# Altium project BACKPMAN3Rev1.0.PrjPcb (part 2 of 2)

## Sheet BACKPMAN30_Intfs.SchDoc
size A3
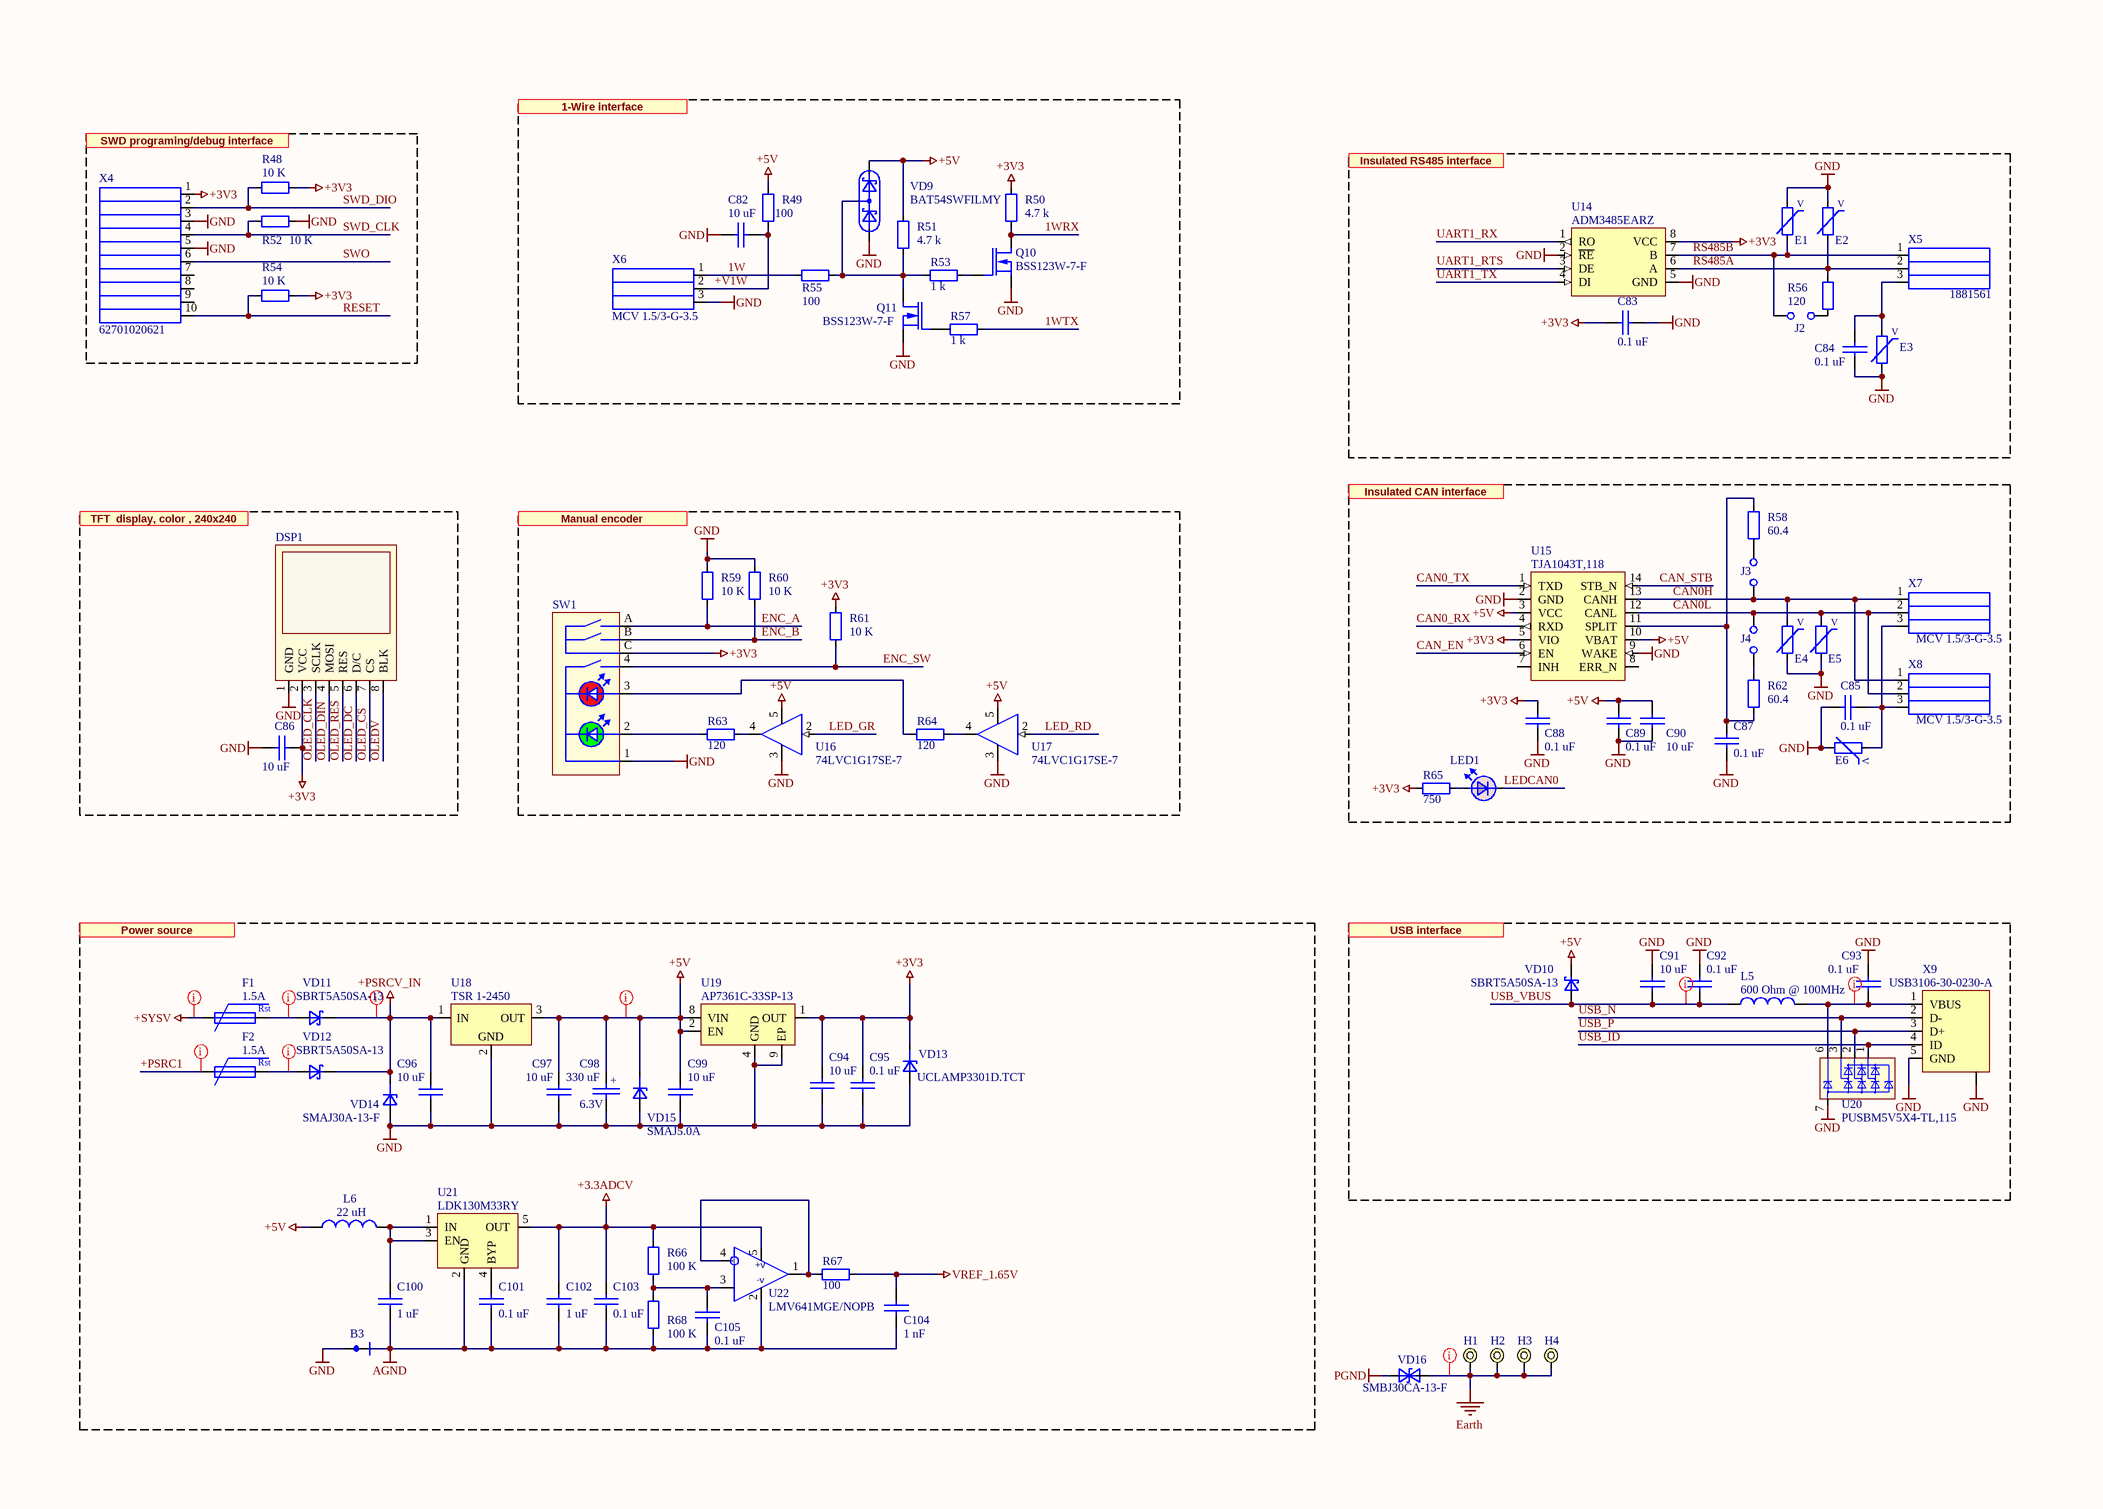
[diagram p2: BACKPMAN30_Intfs.SchDoc]

### Parts
B3  Net tie 0.3mm  [Net tee 0.3 mm]  (value not drawn)  (net tie, no BOM)
C82  value 10 uF  [2012[0805]]  (hidden comment: GRM21BR61E106KA73L)
C83  value 0.1 uF  [1608[0603]]  (hidden comment: 0603B104K500CT)
C84  value 0.1 uF  [1608[0603]]  (hidden comment: CL10B104KA8NNND)
C85  value 0.1 uF  [1608[0603]]  (hidden comment: CL10B104KA8NNND)
C86  value 10 uF  [2012[0805]]  (hidden comment: GRM21BR61E106KA73L)
C87  value 0.1 uF  [1608[0603]]  (hidden comment: CL10B104KA8NNND)
C88  value 0.1 uF  [1608[0603]]  (hidden comment: CL10B104KA8NNND)
C89  value 0.1 uF  [1608[0603]]  (hidden comment: CL10B104KA8NNND)
C90  value 10 uF  [2012[0805]]  (hidden comment: GRM21BR61E106KA73L)
C91  value 10 uF  [2012[0805]]  (hidden comment: GRM21BR61E106KA73L)
C92  value 0.1 uF  [1608[0603]]  (hidden comment: CL10B104KA8NNND)
C93  value 0.1 uF  [1608[0603]]  (hidden comment: CL10B104KA8NNND)
C94  value 10 uF  [2012[0805]]  (hidden comment: GRM21BR61E106KA73L)
C95  value 0.1 uF  [1608[0603]]  (hidden comment: CL10B104KA8NNND)
C96  value 10 uF  [3225[1210]]  (hidden comment: GMC32X7R106K50NT)
C97  value 10 uF  [2012[0805]]  (hidden comment: GRM21BR61E106KA73L)
C98  value 330 uF  Voltage: 6.3V  [T495 D]  (hidden comment: T495D337K006ATE100)
C99  value 10 uF  [2012[0805]]  (hidden comment: GRM21BR61E106KA73L)
C100  value 1 uF  [1608[0603]]  (hidden comment: C1608X5R1H105K080AB)
C101  value 0.1 uF  [1608[0603]]  (hidden comment: 0603B104K500CT)
C102  value 1 uF  [1608[0603]]  (hidden comment: C1608X5R1H105K080AB)
C103  value 0.1 uF  [1608[0603]]  (hidden comment: 0603B104K500CT)
C104  value 1 nF  [0603 CAP]  (hidden comment: Capacitor)
C105  value 0.1 uF  [1608[0603]]  (hidden comment: 0603B104K500CT)
DSP1  1.54_inch_IPS_Module  [1.54 inch IPS 240x240]  (value not drawn)
E1  ESD03A5V5R17V  [0603]  (value not drawn)
E2  ESD03A5V5R17V  [0603]  (value not drawn)
E3  823 560 505 60  [0603]  (value not drawn)
E4  ESD03A5V5R17V  [0603]  (value not drawn)
E5  ESD03A5V5R17V  [0603]  (value not drawn)
E6  ESD03A5V5R17V  [0603]  (value not drawn)
F1  value 1.5A  [2920 (7351 Metric)]  (hidden comment: 0ZCF0075AF2C)
F2  value 1.5A  [2920 (7351 Metric)]  (hidden comment: 0ZCF0075AF2C)
H1  Hole 5MM Plated  [HOLE_5MM plated]  (value not drawn)  (no BOM)
H2  Hole 5MM Plated  [HOLE_5MM plated]  (value not drawn)  (no BOM)
H3  Hole 5MM Plated  [HOLE_5MM plated]  (value not drawn)  (no BOM)
H4  Hole 5MM Plated  [HOLE_5MM plated]  (value not drawn)  (no BOM)
J2  PH1-02-TA-HT  [HDR1X2V]  (value not drawn)
J3  PH1-02-TA-HT  [HDR1X2V]  (value not drawn)
J4  PH1-02-TA-HT  [HDR1X2V]  (value not drawn)
L5  value 600 Ohm @ 100MHz  [0805]  (hidden comment: MPZ2012S601AT000)
L6  value 22 uH  [2518]  (hidden comment: BRC2518T220K)
LED1  SML-211UTT86  [0805 LED]  (value not drawn)
Q10  BSS123W-7-F  [SOT323-3]
Q11  BSS123W-7-F  [SOT323-3]
R48  value 10 K  [0603]  (hidden comment: RMCF0603FT10K0)
R49  value 100  [0603]  (hidden comment: Resistor)
R50  value 4.7 k  [0603]  (hidden comment: Resistor)
R51  value 4.7 k  [0603]  (hidden comment: Resistor)
R52  value 10 K  [0603]  (hidden comment: RMCF0603FT10K0)
R53  value 1 k  [0603]  (hidden comment: Resistor)
R54  value 10 K  [0603]  (hidden comment: RMCF0603FT10K0)
R55  value 100  [0603]  (hidden comment: Resistor)
R56  value 120  [0603]  (hidden comment: Resistor)
R57  value 1 k  [0603]  (hidden comment: Resistor)
R58  value 60.4  [0603]  (hidden comment: Resistor)
R59  value 10 K  [0603]  (hidden comment: RMCF0603FT10K0)
R60  value 10 K  [0603]  (hidden comment: RMCF0603FT10K0)
R61  value 10 K  [0603]  (hidden comment: RMCF0603FT10K0)
R62  value 60.4  [0603]  (hidden comment: Resistor)
R63  value 120  [0603]  (hidden comment: Resistor)
R64  value 120  [0603]  (hidden comment: Resistor)
R65  value 750  [0603]  (hidden comment: Resistor)
R66  value 100 K  [0603]  (hidden comment: RG1608N-104-W-T1)
R67  value 100  [0603]  (hidden comment: Resistor)
R68  value 100 K  [0603]  (hidden comment: RG1608N-104-W-T1)
SW1  PEL12D-4225S-S2024  [PEL12D-4225S-S2024]  (value not drawn)
U14  ADM3485EARZ  [SO-8]
U15  TJA1043T,118  [SOT108-1]
U16  74LVC1G17SE-7  [SOT-353 ON Semi]
U17  74LVC1G17SE-7  [SOT-353 ON Semi]
U18  TSR 1-2450  [TSR 1 Traco Power]
U19  AP7361C-33SP-13  [SOIC-8 EDP]
U20  PUSBM5V5X4-TL,115  [DFN1616-6]
U21  LDK130M33RY  [SOT23-5]
U22  LMV641MGE/NOPB  [SOT-353 ON Semi]
VD9  BAT54SWFILMY  [SOT323-3]
VD10  SBRT5A50SA-13  [SMA]
VD11  SBRT5A50SA-13  [SMA]
VD12  SBRT5A50SA-13  [SMA]
VD13  UCLAMP3301D.TCT  [SOD-323]
VD14  SMAJ30A-13-F  [SMA]
VD15  SMAJ5.0A  [SMA]
VD16  SMBJ30CA-13-F  [DO-214AA_SMBJ BI]
X4  62701020621  [SHF-105-01-L-D-SM]
X5  1881561  [1881561]
X6  MCV 1.5/3-G-3.5  [mcv1.5-3-g_3.5 green + MC 1,5 3-ST-3,5 - 1840379]
X7  MCV 1.5/3-G-3.5  [mcv1.5-3-g_3.5 green + MC 1,5 3-ST-3,5 - 1840379]
X8  MCV 1.5/3-G-3.5  [mcv1.5-3-g_3.5 green + MC 1,5 3-ST-3,5 - 1840379]
X9  USB3106-30-0230-A  [USB3106-30-0230-A]

### Nets
+3.3ADCV: C102.2 C103.1 R66.2 U21.5(OUT) U22.5(V+)
+3V3: C83.1 C86.2 C88.2 C94.2 C95.2 DSP1.2(VCC) R48.2 R50.1 R54.2 R61.2 R65.2 SW1.C U14.8(VCC) U15.5(VIO) U19.1(OUT) VD13.1(C) X4.1
+5V: C89.2 C90.2 C97.2 C98.1 C99.2 L6.1 R49.2 R51.1 U15.3(VCC) U15.10(VBAT) U16.5(VCC) U17.5(VCC) U18.3(OUT) U19.2(EN) U19.8(VIN) VD9.2 VD10.1 VD15.1
+PSRCV_IN: C96.1 U18.1(IN) VD11.1 VD12.1 VD14.1
+SYSV: F1.1
AGND: B3.1 C100.1 C101.2 C102.1 C103.2 C104.2 C105.2 R68.1 U21.2(GND) U22.2(GND)
Earth: H1.0 H2.0 H3.0 H4.0 VD16.2(A)
GND: B3.2 C82.2 C83.2 C84.2 C85.2 C86.1 C87.1 C88.1 C89.1 C90.1 C91.2 C92.2 C93.2 C94.1 C95.1 C96.2 C97.1 C98.2 C99.1 DSP1.1(GND) E1.2 E2.2 E3.1 E4.1 E5.1 E6.1 Q10.2(S) Q11.2(S) R52.2 R59.2 R60.2 SW1.1 U14.2(~{RE}) U14.5(GND) U15.2(GND) U15.9(WAKE) U16.3(GND) U17.3(GND) U18.2(GND) U19.4(GND) U19.9(EP) U20.7 VD9.1 VD13.2(A) VD14.2 VD15.2 X4.3 X4.5 X6.3 X9.0 X9.5(GND)
PGND: VD16.1(C)
VREF_1.65V: C104.1 R67.1
1W: R55.1 X6.1
1WRX: Q10.3(D) R50.2
1WTX: R57.1
+PSRC1: F2.1
+V1W: C82.1 R49.1 X6.2
CAN0_RX: U15.4(RXD)
CAN0_TX: U15.1(TXD)
CAN0H: E4.2 J3.2 U15.13(CANH) X7.1 X8.1
CAN0L: E5.2 J4.1 U15.12(CANL) X7.2 X8.2
CAN_EN: U15.6(EN)
CAN_STB: U15.14(STB_N)
ENC_A: R59.1 SW1.A
ENC_B: R60.1 SW1.B
ENC_SW: R61.1 SW1.4
LED_GR: U16.2(A)
LED_RD: U17.2(A)
LEDCAN0: LED1.2
OLED_CLK: DSP1.3(SCLK)
OLED_CS: DSP1.7(CS)
OLED_DC: DSP1.6(D/C)
OLED_DIN: DSP1.4(MOSI)
OLED_RES: DSP1.5(RES)
OLEDV: DSP1.8(BLK)
RESET: R54.1 X4.10
RS485A: E2.1 R56.2 U14.6(A) X5.2
RS485B: E1.1 J2.1 U14.7(B) X5.1
SWD_CLK: R52.1 X4.4
SWD_DIO: R48.1 X4.2
SWO: X4.6
UART1_RTS: U14.3(DE)
UART1_RX: U14.1(RO)
UART1_TX: U14.4(DI)
USB_ID: U20.1 X9.4(ID)
USB_N: U20.3 X9.2(D-)
USB_P: U20.2 X9.3(D+)
USB_VBUS: C91.1 C92.1 L5.2 VD10.2
NetC84_1: C84.1 E3.2 X5.3
NetC85_1: C85.1 E6.2 X7.3 X8.3
NetC87_2: C87.2 R58.2 R62.1 U15.11(SPLIT)
NetC93_1: C93.1 L5.1 U20.6 X9.1(VBUS)
NetC100_2: C100.2 L6.2 U21.1(IN) U21.3(EN)
NetC101_1: C101.1 U21.4(BYP)
NetC105_1: C105.1 R66.1 R68.2 U22.3(IN+)
NetF1_2: F1.2 VD11.2
NetF2_2: F2.2 VD12.2
NetJ2_2: J2.2 R56.1
NetJ3_1: J3.1 R58.1
NetJ4_2: J4.2 R62.2
NetLED1_1: LED1.1 R65.1
NetQ10_1: Q10.1(G) R53.1
NetQ11_1: Q11.1(G) R57.2
NetQ11_3: Q11.3(D) R51.2 R53.2 R55.2 VD9.3
NetR63_1: R63.1 U16.4(Y)
NetR63_2: R63.2 SW1.2
NetR64_1: R64.1 U17.4(Y)
NetR64_2: R64.2 SW1.3
NetR67_2: R67.2 U22.1(OUT) U22.4(IN-)

Not connected (* = marked no-connect by the designer): U15 7(INH) 8(ERR_N); X4 7 8 9

### Layout directives
net class 24V: +PSRC1, +PSRCV_IN, +SYSV, Earth, NetF1_2, NetF2_2
net class 5V: +5V, NetC93_1, USB_VBUS

### Notes on the sheet
- 1-Wire interface
- SWD programing/debug interface
- Insulated RS485 interface
- Insulated CAN interface
- TFT  display, color , 240x240
- (near R59) Manual encoder
- Power source
- USB interface
- (in symbol 0ZCF0075AF2C) Rst
- (in symbol ESD03A5V5R17V) V
- (in symbol LMV641MGE/NOPB) +v; -v
- (in symbol T495D337K006ATE100) +

### Library data of the parts
C82 C86 C90 C91 C94 C97 C99 = GRM21BR61E106KA73L: 10 µF ±10%, 25V, Ceramic Capacitor X5R 0805 (2012 Metric),  -55°C ~ 85°C; Manufacturer: Murata Electronics; PartNum: 490-5523-1-ND; Distributor: Digi-Key; Price: 0.11$; Tolerance: ±10%; Voltage: 25V; PartName: GRM21BR61E106KA73L
C83-C85 C87-C89 C92 C93 C95 C101 C103 C105 = 0603B104K500CT: as C1 on sheet BACKPMAN30_Charger; Distributor: Digi-Key; PartName: 0603B104K500CT; Price: 0.0062 Euro; Voltage: 50V
C96 = GMC32X7R106K50NT: as C14 on sheet BACKPMAN30_Charger; Distributor: Digi-Key; PartName: GMC32X7R106K50NT; Tolerance: ±10%; Voltage: 50V
C98 = T495D337K006ATE100: 330 µF Molded Tantalum Capacitors 6.3 V 2917 (7343 Metric) 100mOhm, -55°C ~ 125°C; Manufacturer: KEMET; PartNum: 399-3883-1-ND; Tolerance: ±10%; Distributor: Digi-Key; Price: 0.089 Euro; PartName: T495D337K006ATE100
C100 C102 = C1608X5R1H105K080AB: 1 uF, ±10%, Low ESL, 50V, Ceramic Capacitor X5R 0603 (1608 Metric), -55°C ~ 85°C; Manufacturer: Venkel; PartNum: 445-7468-1-ND; Distributor: Digi-Key; PartName: C1608X5R1H105K080AB; Tolerance: ±10%; Voltage: 50V
C104 = CC0603JRX7R9BB102: as C3 on sheet BACKPMAN30_Charger; Voltage - Rated: 50V; Part Number: CC0603JRX7R9BB102; Distributor: Digi-Key; PartName: CC0603JRX7R9BB102; Price: 0.01920; Tolerance: ±5%; Temperature Coefficient: X7R; Operating Temperature: -55°C ~ 125°C; Features: -; Package / Case: 0603 (1608 Metric)
DSP1 = 1.54_inch_IPS_Module: 1.54-inch color screen,support 65K color display, 4-line SPI interface, 240x240 resolution, 32.00x43.72 mm; PartNum: MSP1541; PartName: 1.54 inch IPS Module; Distributor: Aliexpress; Price: 7.36
E1-E6 = ESD03A5V5R17V: Low and Ultra Low Capacitance ESD Suppressor, Voperating=5.5V, Vclamp=17V, < 1nS,1nA, 0603,; Manufacturer: Stackpole Electronics Inc; PartNum: ESD03A5V5R17VCT-ND; Voltage: 17V; Distributor: Digi-Key; PartName: ESD03A5V5R17V; Price: 0.1$
F1 F2 = 0ZCF0075AF2C: PTC RESETTABLE 60V 750MA, It=1.5A, 0.3s 2920(7351); Manufacturer: Bel Fuse Inc.; PartNum: 507-1743-1-ND; Distributor: Digi-Key; PartName: 0ZCF0075AF2C
J2-J4 = PH1-02-UA: Connector Header Through Hole 2 position 0.100" (2.54mm), Contact Length - Mating 6 mm; Manufacturer: Adam Tech; PartNum: 2057-PH1-02-UA-ND; Distributor: Digi-Key; PartName: PH1-02-UA
L5 = MPZ2012S601AT000: FERRITE BEAD 600 OHM, 0805, -55°C ~ 125°C; Manufacturer: TDK Corporation; PartNum: 445-2206-1-ND; Distributor: Digi-Key; Price: 0.05$; PartName: MPZ2012S601AT000
L6 = BRC2518T220K: as L1 on sheet BACKPMAN30_Charger; Distributor: Digi-Key; PartName: BRC2518T220K; Supplier 1: Digi-Key; Supplier Part Number 1: 587-2439-1-ND
LED1 = SML-211UTT86: 0805 red LED, hibright, 2 mA, 1.8V, 130°; Manufacturer: Rohm; PartNum: 511-1292-1-ND; Distributor: Digi-Key; Price: 0.34$; Value: Red; PartName: SML-211UTT86
Q10 Q11 = BSS123W-7-F: MOSFETs N-CH, 2V @ 1mA, 6 Ohm @ 170mA, 10V, 170mA, 100V, SOT-323,  -55°C ~ 150°C; Manufacturer: Diodes Incorporated; PartNum: BSS123W-FDICT-ND; Distributor: Digi-Key; Price: 0.15$; PartName: BSS123W-7-F
R48 R52 R54 R59-R61 = RMCF0603FT10K0: 10 kOhms ±1%, ±100ppm/°C,  0.1W, 1/10W Chip Resistor 0603 (1608 Metric) Automotive AEC-Q200 Thick Film, -55°C ~ 155°C; Manufacturer: Stackpole Electronics Inc; PartNum: RMCF0603FT10K0CT-ND; Distributor: Digi-Key; Price: 0.0017$; Tolerance: 1%; PartName: RMCF0603FT10K0
R49 R55 R67 = RMCF0603FT100R: 100 Ohms, ±1%, 0.1W, 1/10W, Thick Film, ±100ppm/°C, 0603 (1608 Metric), -55°C ~ 155°C, Automotive AEC-Q200; Manufacturer: Stackpole Electronics Inc.; PartNum: RMCF0603FT100RCT-ND; Voltage: 75V; Distributor: Digi-Key; Price: 0.00690; Tolerance: ±1%; PartName: RMCF0603FT100R; Part Number: RMCF0603FT100R; Temperature Coefficient: ±100ppm/°C; Operating Temperature: -55°C ~ 155°C; Power (Watts): 0.1W, 1/10W; Features: Automotive AEC-Q200; Package / Case: 0603 (1608 Metric)
R50 R51 = RMCF0603FT4K70: 4.7 kOhms, ±1%, 0.1W, 1/10W, Thick Film, ±100ppm/°C, 0603 (1608 Metric), -55°C ~ 155°C, Automotive AEC-Q200; Manufacturer: Stackpole Electronics Inc.; PartNum: RMCF0603FT4K70CT-ND; Voltage: 75V; Distributor: Digi-Key; Price: 0.00690; Tolerance: ±1%; PartName: RMCF0603FT4K70; Part Number: RMCF0603FT4K70; Temperature Coefficient: ±100ppm/°C; Operating Temperature: -55°C ~ 155°C; Power (Watts): 0.1W, 1/10W; Features: Automotive AEC-Q200; Package / Case: 0603 (1608 Metric)
R53 R57 = RMCF0603FG1K00: as R23 on sheet BACKPMAN30_Charger; Distributor: Digi-Key; Price: 0.00690; Tolerance: ±1%; PartName: RMCF0603FG1K00; Part Number: RMCF0603FG1K00; Temperature Coefficient: ±100ppm/°C; Operating Temperature: -55°C ~ 155°C; Power (Watts): 0.1W, 1/10W; Features: Automotive AEC-Q200; Package / Case: 0603 (1608 Metric)
R56 R63 R64 = RMCF0603FT120R: 120 Ohms, ±1%, 0.1W, 1/10W, Thick Film, ±100ppm/°C, 0603 (1608 Metric), -55°C ~ 155°C, Automotive AEC-Q200; Manufacturer: Stackpole Electronics Inc.; PartNum: RMCF0603FT120RCT-ND; Voltage: 75V; Distributor: Digi-Key; Price: 0.00690; Tolerance: ±1%; PartName: RMCF0603FT120R; Temperature Coefficient: ±100ppm/°C; Operating Temperature: -55°C ~ 155°C; Power (Watts): 0.1W, 1/10W; Features: Automotive AEC-Q200; Package / Case: 0603 (1608 Metric)
  R63 R64: Part Number: RMCF0603FT120R
R58 R62 = CRCW060360R4FKEA: 60.4 Ohms, ±1%, 0.1W, 1/10W, Thick Film, ±100ppm/°C, 0603 (1608 Metric), -55°C ~ 155°C, Automotive AEC-Q200; Manufacturer: Vishay Dale; PartNum: 541-60.4HCT-ND; Voltage: 75V; Distributor: Digi-Key; Price: 0.01700; Tolerance: ±1%; PartName: CRCW060360R4FKEA; Part Number: CRCW060360R4FKEA; Temperature Coefficient: ±100ppm/°C; Operating Temperature: -55°C ~ 155°C; Power (Watts): 0.1W, 1/10W; Features: Automotive AEC-Q200; Package / Case: 0603 (1608 Metric)
R65 = RMCF0603FT750R: 750 Ohms, ±1%, 0.1W, 1/10W, Thick Film, ±100ppm/°C, 0603 (1608 Metric), -55°C ~ 155°C, Automotive AEC-Q200; Manufacturer: Stackpole Electronics Inc.; PartNum: RMCF0603FT750RCT-ND; Voltage: 75V; Distributor: Digi-Key; Price: 0.00690; Tolerance: ±1%; PartName: RMCF0603FT750R; Temperature Coefficient: ±100ppm/°C; Operating Temperature: -55°C ~ 155°C; Power (Watts): 0.1W, 1/10W; Features: Automotive AEC-Q200; Package / Case: 0603 (1608 Metric)
R66 R68 = RG1608N-104-W-T1: 100 kOhms ±0.05% 0.1W, 1/10W Chip Resistor 0603 (1608 Metric) Anti-Sulfur, Automotive AEC-Q200 Thin Film,-55°C ~ 155°C; Manufacturer: Susumu; PartNum: RG16N100KWCT-ND; Distributor: Digi-Key; Price: 0.002$; Tolerance: ±0.05%; PartName: RG1608N-104-W-T1
SW1 = PEL12D-4225S-S2024: Rotary Encoder Mechanical 24 Quadrature (Incremental) Vertical; Manufacturer: Bourns Inc.; PartNum: PEL12D-4225S-S2024-ND; Distributor: Digi-Key; PartName: PEL12D-4225S-S2024; Price: 3.62$
U14 = ADM3485EARZ: 1/1 Transceiver Half RS422, RS485, VCC 3.3 V,  8-SOIC, -40°C ~ 85°C; Manufacturer: Analog Devices; PartNum: 584-ADM3485EARZ-R7; Price: 2.35$; Distributor: Mouser; PartName: ADM3485EARZ
U15 = TJA1043T,118: 1/1 Transceiver Half CANbus, 5Mbps, 4.5-5.5V, 3V IO,  14-SO, -40°C ~ 150°C; Manufacturer: NXP; PartNum: 2776120RL; Price: 1.41; Distributor: Farnell; PartName: TJA1043T,118
U16 U17 = 74LVC1G17SE-7: IC SGL SCHMITT BUFFER SOT353; Manufacturer: Diodes Incorporated; PartNum: 74LVC1G17SE-7CT-ND; Distributor: Digi-Key; PartName: 74LVC1G17SE-7
U18 = TSR 1-2450: Linear Regulator Replacement DC DC Converter 5W, 5V, 1A, 6.5V - 36V Input, -40°C ~ 85°C; Manufacturer: Traco Power; PartNum: 1951-2747-ND; Distributor: Digi-Key; price: 3.9$; PartName: TSR 1-2450
U19 = AP7361C-33SP-13: LDO, 3.3 V, 1A, 0.36V@1A, Vin=6V max, -40..+85C, 8-SO-EP; PartNum: AP7361C-33SP-13DICT-ND; Manufacturer: Diodes Incorporated; Distributor: Digi-Key; Price: 0.56$; PartName: AP7361C-33SP-13
U20 = PUSBM5V5X4-TL,115: TVS DIODE 5.5VWM 12VC 6HXSON; Manufacturer: NXP Semiconductors; PartNum: 568-10921-1-ND; Distributor: Digi-Key; PartName: PUSBM5V5X4-TL,115
U21 = LDK130M33RY: LDO 3.3 V, 250 mA, Vin < 5.5V, Iq < 12uA, -40..+125 C, SOT23-5; Manufacturer: STMicroelectronics; PartNum: 511-LDK130M33RY; Price: 0.543; Distributor: Mouser; PartName: LDK130M33RY
U22 = LMV641MGE/NOPB: as U1 on sheet BACKPMAN30_Charger; Price: 1.8$; Distributor: Digi-Key; PartName: LMV641MGE/NOPB; Supplier 1: Digi-Key; Supplier Part Number 1: 296-OPA991IDBVRCT-ND
VD9 = BAT54SWFILMY: Series Shottky Diodes array, 40V, 300 mA, SOT-323, -40°C...150°C; Manufacturer: STMicroelectronics; PartNum: 497-17757-1-ND; Distributor: Digi-Key; PartName: BAT54SWFILMY
VD10-VD12 = SBRT5A50SA-13: Schottky Power Rectifier 3A, 40V, SMA; Manufacturer: Diodes Incorporated; PartNum: SBRT5A50SA-13DICT-ND; Price: 0,15$; Distributor: Digi-Key; PartName: SBRT5A50SA-13
VD13 = UCLAMP3301D.TCT: TVS 3.3V (Max), Vbr=3.5V, 9.5V Clamp 10A (8/20µs) Ipp Tvs Diode Surface Mount SOD-323; Manufacturer: Semtech Corporation; PartNum: UCLAMP3301DCT-ND; Distributor: Digi-Key; Value: 3.3V; PartName: UCLAMP3301D.TCT
VD14 = SMAJ30A-13-F: 48.4V Clamp 8.3A Ipp Tvs Diode Surface Mount SMA,; Manufacturer: Diodes Incorporated; PartNum: SMAJ30A-FDICT-ND; Voltage: 30 V; Distributor: Digi-Key; Price: 0.18$; PartName: SMAJ30A-13-F
VD15 = SMAJ5.0A: 9.2V Clamp 43.5A Ipp Tvs Diode Surface Mount SMA, -55°C ~ 150°C (TJ); Manufacturer: Littelfuse Inc.; PartNum: SMAJ5.0ALFCT-ND; Voltage: 30 V; Distributor: Digi-Key; Price: 0.18$; PartName: SMAJ5.0A
VD16 = SMBJ30CA-13-F: TVS 600W, Vbr=33.3V, Vcl=48.4V,  Bidirectional, SMB, -55°C ~ 150°C; Manufacturer: Diodes Incorporated; PartNum: SMBJ30CA-FDICT-ND; Voltage: 30V; Distributor: Digi-Key; Price: 0.21$; PartName: SMBJ30CA-13-F; Supplier 1: Digi-Key; Supplier Part Number 1: SMBJ30CA-FDICT-ND
X4 = 62701020621: 10 Positions Header Connector 0.050" (1.27mm) Surface Mount Gold; Manufacturer: Wurth; Distributor: we-online.com; Price: 4.36$; PartNum: 62701020621; PartName: 62701020621
X5 = 1881561: Printed-circuit board connector - MCV 0,5/ 3-G-2,5 - 1881561; Manufacturer: Phoenix Contact; Distributor: Phoenix Contact; Price: 0.33; PartNum: 1881561; PartName: MCV 0,5/ 3-G-2,5
X6-X8 = MCV 1.5/3-G-3.5: HEADER, VERTICAL, 3.5MM, 3WAY; Manufacturer: PHOENIX CONTACT; PartNum: 1843619; PartName: MCV 1,5/3-G-3,5; Distributor: Farnell
X9 = USB3106-30-0230-A: USB - micro AB USB 2.0 Receptacle Connector 5 Position Through Hole; Manufacturer: GCT; PartNum: 2073-USB3106-30-0230-ACT-ND; Distributor: Digi-Key; Price: 0.63$; PartName: USB3106-30-0230-A

## Sheet BACKPMAN30_PwrSw.SchDoc
size A3
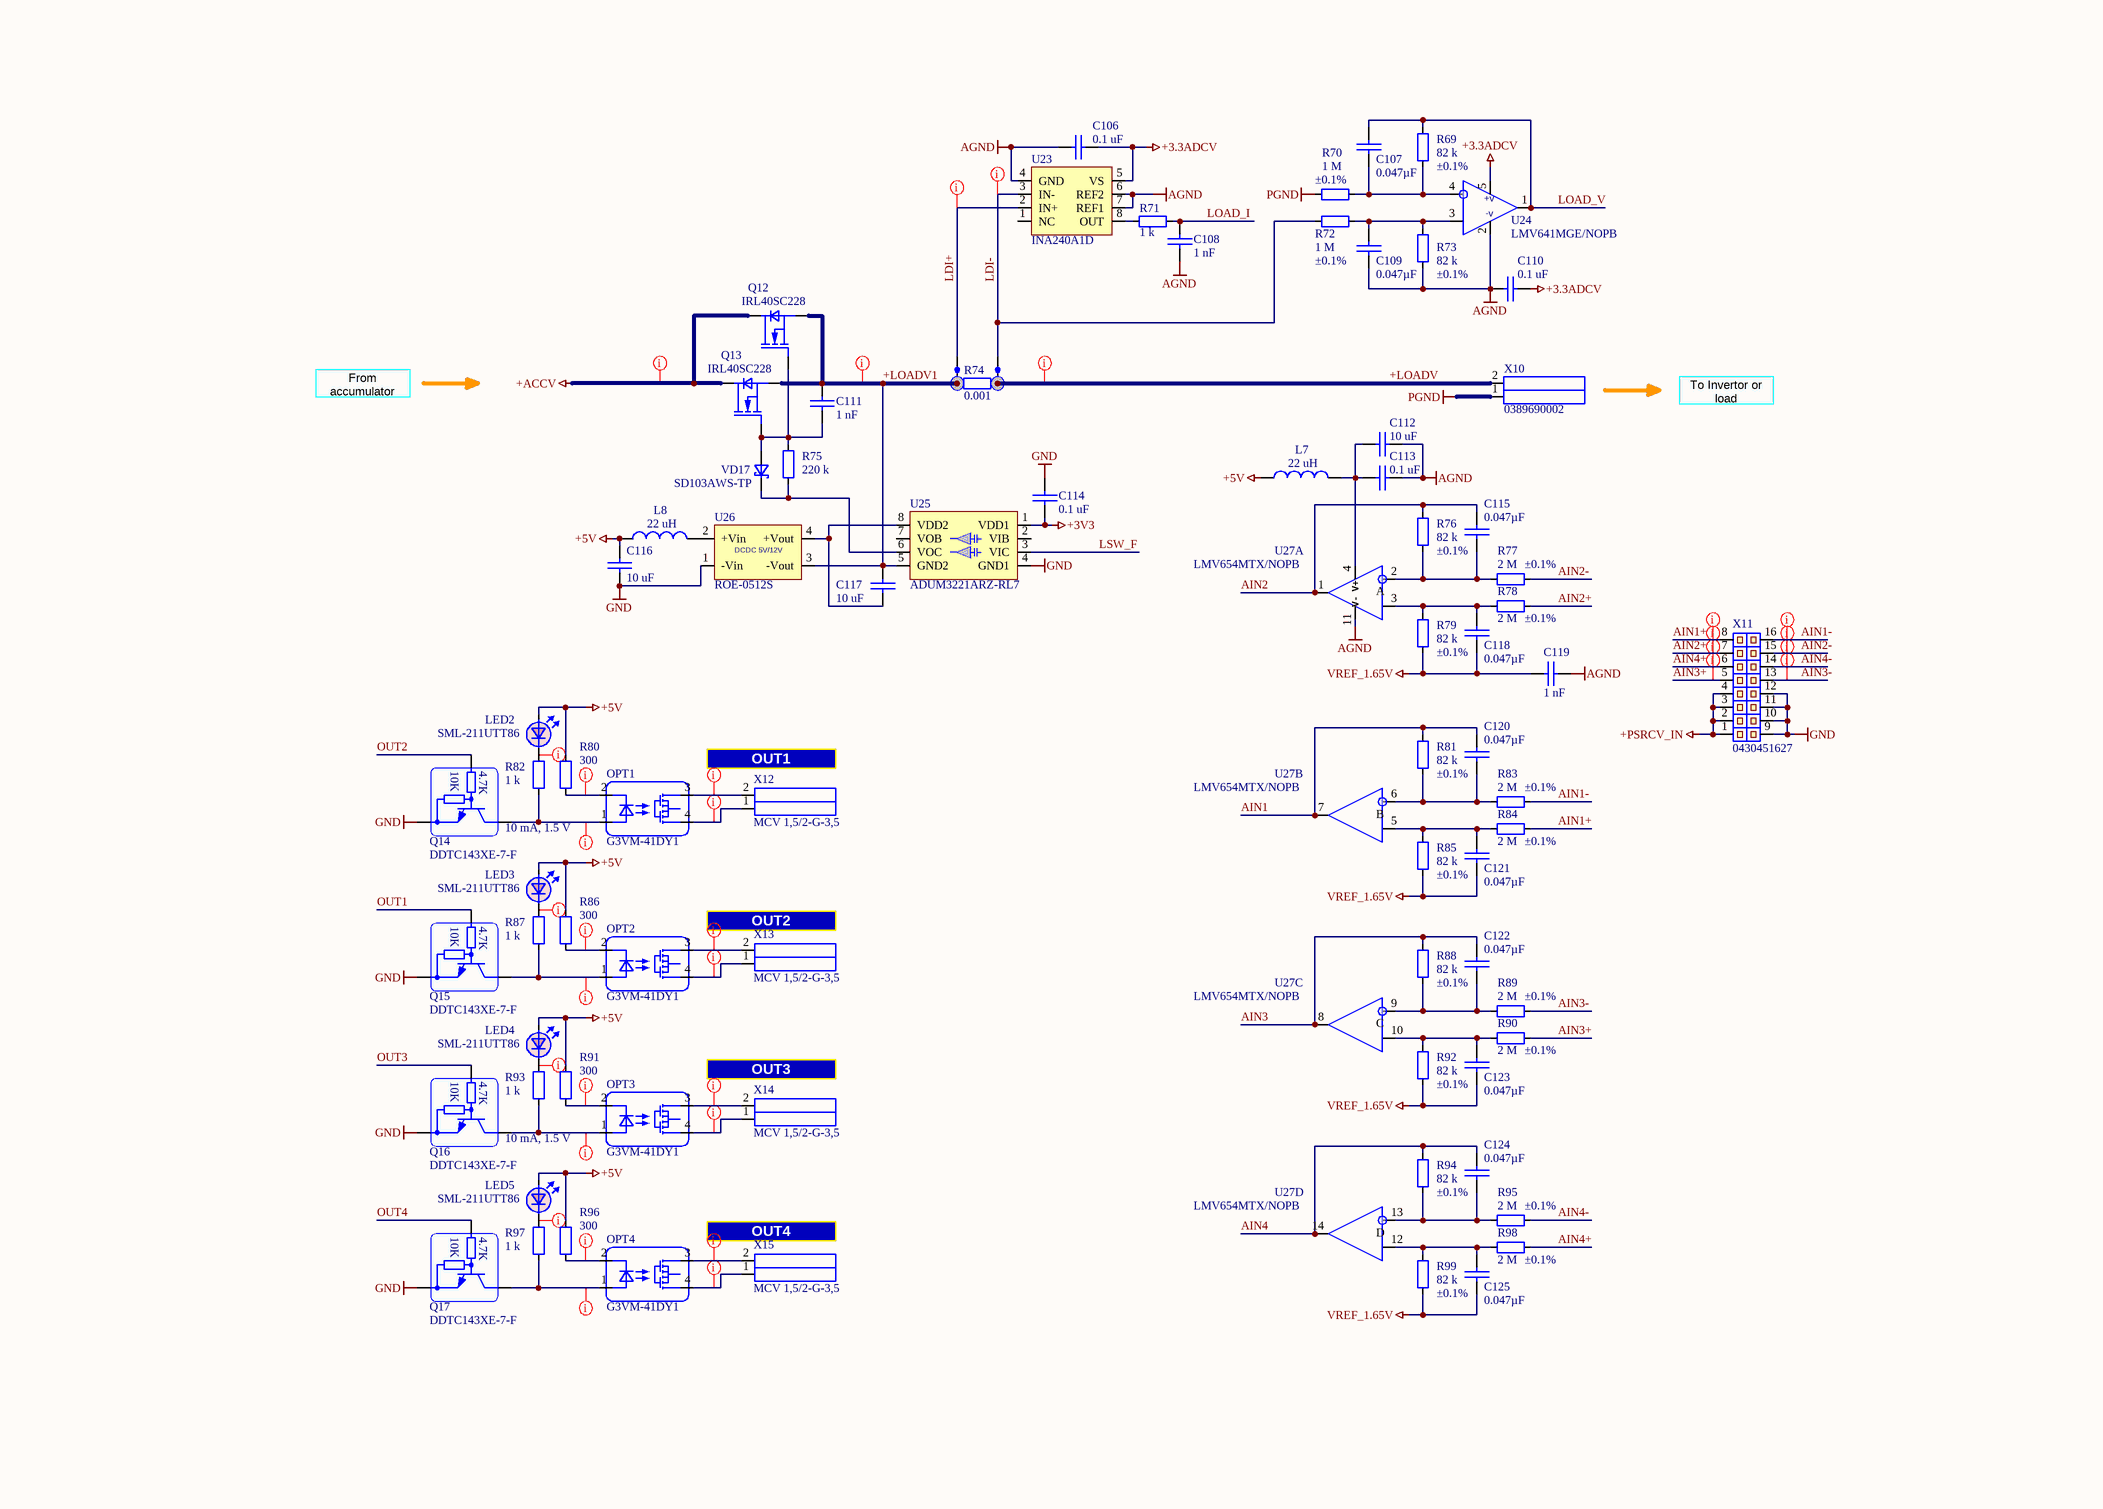
[diagram p3: BACKPMAN30_PwrSw.SchDoc]

### Parts
B4  Net tie 0.3mm  [Net tee 0.3 mm]  (value not drawn)  (net tie, no BOM)
B5  Net tie 0.3mm  [Net tee 0.3 mm]  (value not drawn)  (net tie, no BOM)
C106  value 0.1 uF  [1608[0603]]  (hidden comment: 0603B104K500CT)
C107  value 0.047µF  [0603 CAP]  (hidden comment: Capacitor)
C108  value 1 nF  [0603 CAP]  (hidden comment: Capacitor)
C109  value 0.047µF  [0603 CAP]  (hidden comment: Capacitor)
C110  value 0.1 uF  [1608[0603]]  (hidden comment: 0603B104K500CT)
C111  value 1 nF  [0603 CAP]  (hidden comment: Capacitor)
C112  value 10 uF  [3225[1210]]  (hidden comment: GMC32X7R106K50NT)
C113  value 0.1 uF  [1608[0603]]  (hidden comment: 0603B104K500CT)
C114  value 0.1 uF  [1608[0603]]  (hidden comment: CL10B104KA8NNND)
C115  value 0.047µF  [0603 CAP]  (hidden comment: Capacitor)
C116  value 10 uF  [3225[1210]]  (hidden comment: GMC32X7R106K50NT)
C117  value 10 uF  [3225[1210]]  (hidden comment: GMC32X7R106K50NT)
C118  value 0.047µF  [0603 CAP]  (hidden comment: Capacitor)
C119  value 1 nF  [0603 CAP]  (hidden comment: Capacitor)
C120  value 0.047µF  [0603 CAP]  (hidden comment: Capacitor)
C121  value 0.047µF  [0603 CAP]  (hidden comment: Capacitor)
C122  value 0.047µF  [0603 CAP]  (hidden comment: Capacitor)
C123  value 0.047µF  [0603 CAP]  (hidden comment: Capacitor)
C124  value 0.047µF  [0603 CAP]  (hidden comment: Capacitor)
C125  value 0.047µF  [0603 CAP]  (hidden comment: Capacitor)
L7  value 22 uH  [2518]  (hidden comment: BRC2518T220K)
L8  value 22 uH  [2518]  (hidden comment: BRC2518T220K)
LED2  SML-211UTT86  [0805 LED]
LED3  SML-211UTT86  [0805 LED]
LED4  SML-211UTT86  [0805 LED]
LED5  SML-211UTT86  [0805 LED]
OPT1  G3VM-41DY1  [4-SMD Omron]
OPT2  G3VM-41DY1  [4-SMD Omron]
OPT3  G3VM-41DY1  [4-SMD Omron]
OPT4  G3VM-41DY1  [4-SMD Omron]
Q12  IRL40SC228  [D2Pak-7pin]
Q13  IRL40SC228  [D2Pak-7pin]
Q14  DDTC143XE-7-F  [SOT-523F]
Q15  DDTC143XE-7-F  [SOT-523F]
Q16  DDTC143XE-7-F  [SOT-523F]
Q17  DDTC143XE-7-F  [SOT-523F]
R69  value 82 k  Tolerance: ±0.1%  [0603]  (hidden comment: Resistor)
R70  value 1 M  Tolerance: ±0.1%  [0805]  (hidden comment: RT0805BRE071ML)
R71  value 1 k  [0603]  (hidden comment: Resistor)
R72  value 1 M  Tolerance: ±0.1%  [0805]  (hidden comment: RT0805BRE071ML)
R73  value 82 k  Tolerance: ±0.1%  [0603]  (hidden comment: Resistor)
R74  value 0.001  [WSR52L000FEA]  (hidden comment: WSR51L000FEA)
R75  value 220 k  [0603]  (hidden comment: Resistor)
R76  value 82 k  Tolerance: ±0.1%  [0603]  (hidden comment: Resistor)
R77  value 2 M  Tolerance: ±0.1%  [0805]  (hidden comment: CPF0805B2M0E)
R78  value 2 M  Tolerance: ±0.1%  [0805]  (hidden comment: CPF0805B2M0E)
R79  value 82 k  Tolerance: ±0.1%  [0603]  (hidden comment: Resistor)
R80  value 300  [0603]  (hidden comment: Resistor)
R81  value 82 k  Tolerance: ±0.1%  [0603]  (hidden comment: Resistor)
R82  value 1 k  [0603]  (hidden comment: Resistor)
R83  value 2 M  Tolerance: ±0.1%  [0805]  (hidden comment: CPF0805B2M0E)
R84  value 2 M  Tolerance: ±0.1%  [0805]  (hidden comment: CPF0805B2M0E)
R85  value 82 k  Tolerance: ±0.1%  [0603]  (hidden comment: Resistor)
R86  value 300  [0603]  (hidden comment: Resistor)
R87  value 1 k  [0603]  (hidden comment: Resistor)
R88  value 82 k  Tolerance: ±0.1%  [0603]  (hidden comment: Resistor)
R89  value 2 M  Tolerance: ±0.1%  [0805]  (hidden comment: CPF0805B2M0E)
R90  value 2 M  Tolerance: ±0.1%  [0805]  (hidden comment: CPF0805B2M0E)
R91  value 300  [0603]  (hidden comment: Resistor)
R92  value 82 k  Tolerance: ±0.1%  [0603]  (hidden comment: Resistor)
R93  value 1 k  [0603]  (hidden comment: Resistor)
R94  value 82 k  Tolerance: ±0.1%  [0603]  (hidden comment: Resistor)
R95  value 2 M  Tolerance: ±0.1%  [0805]  (hidden comment: CPF0805B2M0E)
R96  value 300  [0603]  (hidden comment: Resistor)
R97  value 1 k  [0603]  (hidden comment: Resistor)
R98  value 2 M  Tolerance: ±0.1%  [0805]  (hidden comment: CPF0805B2M0E)
R99  value 82 k  Tolerance: ±0.1%  [0603]  (hidden comment: Resistor)
U23  INA240A1D  [8-SOIC Linear]
U24  LMV641MGE/NOPB  [SOT-353 ON Semi]
U25  ADUM3221ARZ-RL7  [8-SOIC Linear]
U26  ROE-0512S  [Recom 4-SIP module]
U27  LMV654MTX/NOPB  [14 TSSOP Maxim]  (parts A,B,C,D of 4)
VD17  SD103AWS-TP  [SOD323]
X10  0389690002  [Molex 389690002]
X11  0430451627  [0430451627]
X12  MCV 1,5/2-G-3,5  [mcv1.5-2-g_3.5 Green  + MC 1,5 2-ST-3,5 - 1840366]
X13  MCV 1,5/2-G-3,5  [mcv1.5-2-g_3.5 Green  + MC 1,5 2-ST-3,5 - 1840366]
X14  MCV 1,5/2-G-3,5  [mcv1.5-2-g_3.5 Green  + MC 1,5 2-ST-3,5 - 1840366]
X15  MCV 1,5/2-G-3,5  [mcv1.5-2-g_3.5 Green  + MC 1,5 2-ST-3,5 - 1840366]

### Nets
+3.3ADCV: C106.1 C110.1 U23.5(VS) U24.5(V+)
+3V3: C114.1 U25.1(VDD1)
+5V: C116.1 L7.1 L8.1 LED2.1 LED3.1 LED4.1 LED5.1 R80.2 R86.2 R91.2 R96.2
+ACCV: Q12.2(D) Q13.2(D)
+PSRCV_IN: X11.1 X11.2 X11.3 X11.4
AGND: C106.2 C108.1 C109.2 C110.2 C112.2 C113.2 C119.1 R73.1 U23.4(GND) U23.6(REF2) U23.7(REF1) U24.2(GND) U27.11(V-)
GND: C114.2 C116.2 Q14.2(E) Q15.2(E) Q16.2(E) Q17.2(E) U25.4(GND1) U26.1(-Vin) X11.9 X11.10 X11.11 X11.12
PGND: R70.1 X10.1
VREF_1.65V: C118.2 C119.2 C121.2 C123.2 C125.2 R79.1 R85.1 R92.1 R99.1
+LOADV: B5.1 R74.1 X10.2
+LOADV1: B4.1 C111.2 C117.1 Q12.3(S) Q13.3(S) R74.2 U25.5(GND2) U26.3(-Vout)
AIN1: C120.1 R81.2 U27.7(OUT)
AIN1+: R84.1 X11.8
AIN1-: R83.1 X11.16
AIN2: C115.1 R76.2 U27.1(OUT)
AIN2+: R78.1 X11.7
AIN2-: R77.1 X11.15
AIN3: C122.1 R88.2 U27.8(OUT)
AIN3+: R90.1 X11.5
AIN3-: R89.1 X11.13
AIN4: C124.1 R94.2 U27.14(OUT)
AIN4+: R98.1 X11.6
AIN4-: R95.1 X11.14
LDI+: B4.2 U23.2(IN+)
LDI-: B5.2 R72.1 U23.3(IN-)
LOAD_I: C108.2 R71.2
LOAD_V: C107.1 R69.2 U24.1(OUT)
LSW_F: U25.3(VIC)
OUT1: Q15.1(B)
OUT2: Q14.1(B)
OUT3: Q16.1(B)
OUT4: Q17.1(B)
NetC107_2: C107.2 R69.1 R70.2 U24.4(IN-)
NetC109_1: C109.1 R72.2 R73.2 U24.3(IN+)
NetC111_1: C111.1 Q12.1(G) Q13.1(G) R75.2 VD17.1(A)
NetC112_1: C112.1 C113.1 L7.2 U27.4(V+)
NetC115_2: C115.2 R76.1 R77.2 U27.2(IN-)
NetC117_2: C117.2 U25.8(VDD2) U26.4(+Vout)
NetC118_1: C118.1 R78.2 R79.2 U27.3(IN+)
NetC120_2: C120.2 R81.1 R83.2 U27.6(IN-)
NetC121_1: C121.1 R84.2 R85.2 U27.5(IN+)
NetC122_2: C122.2 R88.1 R89.2 U27.9(IN-)
NetC123_1: C123.1 R90.2 R92.2 U27.10(IN+)
NetC124_2: C124.2 R94.1 R95.2 U27.13(IN-)
NetC125_1: C125.1 R98.2 R99.2 U27.12(IN+)
NetL8_2: L8.2 U26.2(+Vin)
NetLED2_2: LED2.2 R82.2
NetLED3_2: LED3.2 R87.2
NetLED4_2: LED4.2 R93.2
NetLED5_2: LED5.2 R97.2
NetOPT1_1: OPT1.1 Q14.3(C) R82.1
NetOPT1_2: OPT1.2 R80.1
NetOPT1_3: OPT1.3 X12.2
NetOPT1_4: OPT1.4 X12.1
NetOPT2_1: OPT2.1 Q15.3(C) R87.1
NetOPT2_2: OPT2.2 R86.1
NetOPT2_3: OPT2.3 X13.2
NetOPT2_4: OPT2.4 X13.1
NetOPT3_1: OPT3.1 Q16.3(C) R93.1
NetOPT3_2: OPT3.2 R91.1
NetOPT3_3: OPT3.3 X14.2
NetOPT3_4: OPT3.4 X14.1
NetOPT4_1: OPT4.1 Q17.3(C) R97.1
NetOPT4_2: OPT4.2 R96.1
NetOPT4_3: OPT4.3 X15.2
NetOPT4_4: OPT4.4 X15.1
NetR71_1: R71.1 U23.8(OUT)
NetR75_1: R75.1 U25.6(VOC) VD17.2(C)

Not connected (* = marked no-connect by the designer): U23 1(NC); U25 2(VIB) 7(VOB)

### Layout directives
net class 24V: +ACCV, +LOADV, +LOADV1, AIN1+, AIN1-, AIN2+, AIN2-, AIN3+, AIN3-, AIN4+, AIN4-, LDI+, LDI-, NetOPT1_3, NetOPT1_4, NetOPT2_3, NetOPT2_4, NetOPT3_3, NetOPT3_4, NetOPT4_3, NetOPT4_4
net class 5V: NetLED2_2, NetLED3_2, NetLED4_2, NetLED5_2, NetOPT1_1, NetOPT1_2, NetOPT2_1, NetOPT2_2, NetOPT3_1, NetOPT3_2, NetOPT4_1, NetOPT4_2

### Notes on the sheet
- From accumulator
- To Invertor or load
- OUT1
- (near Q14) 10 mA, 1.5 V
- OUT2
- OUT3
- (near Q16) 10 mA, 1.5 V
- OUT4
- (in symbol DDTC143XE-7-F) 10K; 4.7K
- (in symbol LMV641MGE/NOPB) +v; -v
- (in symbol LMV654MTX/NOPB, part A) A
- (in symbol LMV654MTX/NOPB, part B) B
- (in symbol LMV654MTX/NOPB, part C) C
- (in symbol LMV654MTX/NOPB, part D) D
- (in symbol ROE-0512S) DCDC 5V/12V

### Library data of the parts
C106 C110 C113 C114 = 0603B104K500CT: 0.1 µF ±10% 50V Ceramic Capacitor X7R 0603 (1608 Metric), -55°C ~ 125°C; Manufacturer: Walsin Technology Corporation; PartNum: 1292-1643-1-ND; Tolerance: +-10%; Distributor: Digi-Key; PartName: 0603B104K500CT; Price: 0.0062 Euro; Voltage: 50V
C107 C109 C115 C118 C120-C125 = CC0603JRX7R9BB473: 0.047µF, ±5%, 50V, X7R, 0603 (1608 Metric), -55°C ~ 125°C, -, General Purpose; Manufacturer: Yageo; PartNum: 311-4019-1-ND; Part Number: CC0603JRX7R9BB473; Distributor: Digi-Key; PartName: CC0603JRX7R9BB473; Price: 0.03660; Tolerance: ±5%; Voltage - Rated: 50V; Temperature Coefficient: X7R; Operating Temperature: -55°C ~ 125°C; Features: -; Package / Case: 0603 (1608 Metric)
C108 C111 C119 = CC0603JRX7R9BB102: 1000pF, ±5%, 50V, X7R, 0603 (1608 Metric), -55°C ~ 125°C, -, General Purpose; Manufacturer: Yageo; PartNum: 311-3361-1-ND; Voltage - Rated: 50V; Part Number: CC0603JRX7R9BB102; Distributor: Digi-Key; PartName: CC0603JRX7R9BB102; Price: 0.01920; Tolerance: ±5%; Temperature Coefficient: X7R; Operating Temperature: -55°C ~ 125°C; Features: -; Package / Case: 0603 (1608 Metric)
C112 C116 C117 = GMC32X7R106K50NT: 10 µF ±10%, 50V, Ceramic Capacitor X7R, 1210 (3225 Metric), -55°C ~ 125°C; Manufacturer: CAL-CHIP ELECTRONICS, INC.; PartNum: 2571-GMC32X7R106K50NTTR-ND; Distributor: Digi-Key; PartName: GMC32X7R106K50NT; Tolerance: ±10%; Voltage: 50V
L7 L8 = BRC2518T220K: 22 µH Unshielded Wirewound Inductor, 490 mA, 560mOhm, 1007 (2518 Metric); Manufacturer: Taiyo Yuden; PartNum: 587-2439-1-ND; Tolerance: ±10%; Distributor: Digi-Key; PartName: BRC2518T220K; Supplier 1: Digi-Key; Supplier Part Number 1: 587-2439-1-ND
LED2-LED5 = SML-211UTT86: 0805 red LED, hibright, 2 mA, 1.8V, 130°; Manufacturer: Rohm; PartNum: 511-1292-1-ND; Distributor: Digi-Key; Price: 0.34$; Value: Red; PartName: SML-211UTT86
OPT1-OPT4 = G3VM-41DY1: Solid State AC DC SPST-NO (1 Form A), 0-40V, 2A, 4-SMD (0.300", 7.62mm); Manufacturer: Omron Electronics Inc-EMC Div; PartNum: Z5418CT-ND; Distributor: Digi-Key; Price: 2.9$; PartName: G3VM-41DY1
Q12 Q13 = IRL40SC228: N-Channel 40 V 557A (Tc) 416W (Tc), 0.65mOhm @ 100A, 10V,  Surface Mount D2PAK (7-Lead); Manufacturer: Infineon Technologies; PartNum: IRL40SC228CT-ND; Distributor: Digi-Key; Price: 3.22$; PartName: IRL40SC228
Q14-Q17 = DDTC143XE-7-F: Pre-Biased Bipolar Transistor (BJT) NPN - Pre-Biased 50 V 100 mA 250 MHz 150 mW Surface Mount SOT-523; Manufacturer: Diodes Incorporated; PartNum: DDTC143XE-FDICT-ND; Price: 0.07$; Distributor: Digi-Key; PartName: DDTC143XE-7-F
R69 R73 R76 R79 R81 R85 R88 R92 R94 R99 = ERA-3AEB823V: 82 kOhms, ±0.1%, 0.1W, 1/10W, Thin Film, ±25ppm/°C, 0603 (1608 Metric), -55°C ~ 155°C, Automotive AEC-Q200; Manufacturer: Panasonic Electronic Components; PartNum: P82KDBCT-ND; Voltage: 75V; Distributor: Digi-Key; Price: 0.26; PartName: ERA-3AEB823V; Part Number: ERA-3AEB823V; Temperature Coefficient: ±25ppm/°C; Operating Temperature: -55°C ~ 155°C; Power (Watts): 0.1W, 1/10W; Features: Automotive AEC-Q200; Package / Case: 0603 (1608 Metric)
R70 R72 = RT0805BRE071ML: 1M, ±0.1%, ±50ppm/°C, 0.125W, 1/8W Chip Resistor 0805 (2012 Metric) - Thin Film,-55°C ~ 155°C; Manufacturer: YAGEO; PartNum: YAG4967CT-ND; Distributor: Digi-Key; Price: 0.09$; PartName: RT0805BRE071ML
R71 R82 R87 R93 R97 = RMCF0603FG1K00: 1 kOhms, ±1%, 0.1W, 1/10W, Thick Film, ±100ppm/°C, 0603 (1608 Metric), -55°C ~ 155°C, Automotive AEC-Q200; Manufacturer: Stackpole Electronics Inc.; PartNum: RMCF0603FG1K00CT-ND; Voltage: 75V; Distributor: Digi-Key; Price: 0.00690; Tolerance: ±1%; PartName: RMCF0603FG1K00; Part Number: RMCF0603FG1K00; Temperature Coefficient: ±100ppm/°C; Operating Temperature: -55°C ~ 155°C; Power (Watts): 0.1W, 1/10W; Features: Automotive AEC-Q200; Package / Case: 0603 (1608 Metric)
R74 = WSR51L000FEA: Curr.sens.res. 0.001 OHM 5W 1% 4527 SMD; Manufacturer: Vishay/Dale; PartNum: WSRC-.001CT-ND; Distributor: Digi-Key; Price: 5.27$; Tolerance: 1%; PartName: WSR51L000FEA
R75 = RMCF0603FT220K: 220 kOhms, ±1%, 0.1W, 1/10W, Thick Film, ±100ppm/°C, 0603 (1608 Metric), -55°C ~ 155°C, Automotive AEC-Q200; Manufacturer: Stackpole Electronics Inc.; PartNum: RMCF0603FT220KCT-ND; Voltage: 75V; Distributor: Digi-Key; Price: 0.00690; Tolerance: ±1%; PartName: RMCF0603FT220K; Part Number: RMCF0603FT220K; Temperature Coefficient: ±100ppm/°C; Operating Temperature: -55°C ~ 155°C; Power (Watts): 0.1W, 1/10W; Features: Automotive AEC-Q200; Package / Case: 0603 (1608 Metric)
R77 R78 R83 R84 R89 R90 R95 R98 = CPF0805B2M0E: 2M, ±0.1%, ±25ppm/°C, 0.125W, 1/8W Chip Resistor 0805 (2012 Metric) - Thin Film,-55°C ~ 155°C; Manufacturer: TE Connectivity Passive Product; PartNum: A119974CT-ND; Distributor: Digi-Key; Price: 0.19$; PartName: CPF0805B2M0E
R80 R86 R91 R96 = RMCF0603FT300R: 300 Ohms, ±1%, 0.1W, 1/10W, Thick Film, ±100ppm/°C, 0603 (1608 Metric), -55°C ~ 155°C, Automotive AEC-Q200; Manufacturer: Stackpole Electronics Inc.; PartNum: RMCF0603FT300RCT-ND; Voltage: 75V; Distributor: Digi-Key; Price: 0.00690; Tolerance: ±1%; PartName: RMCF0603FT300R; Part Number: RMCF0603FT300R; Temperature Coefficient: ±100ppm/°C; Operating Temperature: -55°C ~ 155°C; Power (Watts): 0.1W, 1/10W; Features: Automotive AEC-Q200; Package / Case: 0603 (1608 Metric)
U23 = INA240A1D: Current Sense Amplifier, 20V/V, 2V/us, 400KHz, -40°C ~ 125°C, 8-SOIC; Manufacturer: Texas Instruments; PartNum: 296-48837-ND; Price: 3.0$; Distributor: Digi-Key; PartName: INA240A1D; Supplier 1: Digi-Key; Supplier Part Number 1: 296-50472-1-ND
U24 = LMV641MGE/NOPB: OpAmp,  Rail-to-Rail,  10MHz, VSS 2.7V ~ 12V, Vofs 30µV,  SC-70-5, -40°C ~ 125°C; Manufacturer: Texas Instruments; PartNum: LMV641MGE/NOPBCT-ND; Price: 1.8$; Distributor: Digi-Key; PartName: LMV641MGE/NOPB; Supplier 1: Digi-Key; Supplier Part Number 1: 296-OPA991IDBVRCT-ND
U25 = ADUM3221ARZ-RL7: 4A Gate Driver Magnetic Coupling 2500Vrms 2 Channel 8-SOIC, -40°C ~ 125°C; Manufacturer: Analog Devices Inc.; PartNum: ADUM3221ARZ-RL7CT-ND; Distributor: Digi-Key; Price: 3.1$; PartName: ADUM3221ARZ-RL7
U26 = ROE-0512S: Isolated Module DC DC Converter 1 Output 12V - - 84mA 4.5V - 5.5V Input; Manufacturer: Recom Power; PartNum: ROE-0512S-ND; Price: 2.8$; Distributor: Digi-Key; PartName: ROE-0512S; Supplier 1: Digi-Key; Supplier Part Number 1: ROE-0512S-ND
U27 = LMV654MTX/NOPB: General Purpose Amplifier 4 Circuit, Rail-to-Rail,  Vcc 2.7-5.5V, Uoffs 100 uV, 12 MHz,  14-TSSOP, -40°C ~ 125°C; Manufacturer: Texas Instruments; PartNum: 296-42685-1-ND; Price: 1.7$; Distributor: Digi-Key; PartName: LMV654MTX/NOPB
VD17 = SD103AWS-TP: Diode Schottky 40 V 350mA Surface Mount SOD-323, -65°C ~ 125°C; Manufacturer: Micro Commercial Co; PartNum: SD103AWSTPMSCT-ND; PartName: SD103AWS-TP; Distributor: Digi-Key; Price: 0.1$
X10 = 0389690002: 2 Circuit 0.500" (12.70mm) Barrier Block Connector Screws with Captive Plate, 50A, 600V, 8-20AWG; Manufacturer: Molex; PartNum: WM7469-ND; Distributor: Digi-Key; Price: 1.03$; PartName: 0389690002
X11 = 0430451627: Connector Header Through Hole 16 position 0.118" (3.00mm); Manufacturer: Molex; PartNum: WM10708-ND; Distributor: Digi-Key; Price: 2.6$; PartName: 0430451627
X12-X15 = MCV 1,5/2-G-3,5: HEADER, VERTICAL, 3.5MM, 2WAY; Manufacturer: PHOENIX CONTACT; PartNum: 1843606; Distributor: Farnell; PartName: MCV 1,5/2-G-3,5

## Nets that join several sheets
+3.3ADCV: BACKPMAN30_Charger (11 pins), BACKPMAN30_CPU (C79.2 C80.1 C81.1 U13.H1), BACKPMAN30_Intfs (5 pins), BACKPMAN30_PwrSw (C106.1 C110.1 U23.5 U24.5)
+3V3: BACKPMAN30_Charger (8 pins), BACKPMAN30_CPU (23 pins), BACKPMAN30_Intfs (17 pins), BACKPMAN30_PwrSw (C114.1 U25.1)
+5V: BACKPMAN30_Charger (5 pins), BACKPMAN30_Intfs (18 pins), BACKPMAN30_PwrSw (11 pins)
+ACCV: BACKPMAN30_Charger (U4.1 U4.2 X2.1), BACKPMAN30_PwrSw (Q12.2 Q13.2)
+PSRCV_IN: BACKPMAN30_Intfs (5 pins), BACKPMAN30_PwrSw (X11.1 X11.2 X11.3 X11.4)
+SYSV: BACKPMAN30_Charger (16 pins), BACKPMAN30_Intfs (F1.1)
AGND: BACKPMAN30_Charger (22 pins), BACKPMAN30_CPU (C79.1 C80.2 C81.2 U13.G1), BACKPMAN30_Intfs (10 pins), BACKPMAN30_PwrSw (13 pins)
GND: BACKPMAN30_Charger (13 pins), BACKPMAN30_CPU (30 pins), BACKPMAN30_Intfs (51 pins), BACKPMAN30_PwrSw (12 pins)
PGND: BACKPMAN30_Charger (36 pins), BACKPMAN30_Intfs (VD16.1), BACKPMAN30_PwrSw (R70.1 X10.1)
VREF_1.65V: BACKPMAN30_Charger (C7.2 C8.2 U3.6 U4.6), BACKPMAN30_CPU (U13.G2), BACKPMAN30_Intfs (C104.1 R67.1), BACKPMAN30_PwrSw (9 pins)
1WRX: BACKPMAN30_CPU (U13.H5), BACKPMAN30_Intfs (Q10.3 R50.2)
1WTX: BACKPMAN30_CPU (U13.J5), BACKPMAN30_Intfs (R57.1)
+PSRC1: BACKPMAN30_Charger (7 pins), BACKPMAN30_Intfs (F2.1)
ACC_I: BACKPMAN30_Charger (C3.1 R5.1), BACKPMAN30_CPU (U13.J3)
ACC_V: BACKPMAN30_Charger (C19.1 R15.2 U9.1), BACKPMAN30_CPU (U13.G4)
AIN1: BACKPMAN30_CPU (U13.J2), BACKPMAN30_PwrSw (C120.1 R81.2 U27.7)
AIN2: BACKPMAN30_CPU (U13.H2), BACKPMAN30_PwrSw (C115.1 R76.2 U27.1)
AIN3: BACKPMAN30_CPU (U13.K2), BACKPMAN30_PwrSw (C122.1 R88.2 U27.8)
AIN4: BACKPMAN30_CPU (U13.K4), BACKPMAN30_PwrSw (C124.1 R94.2 U27.14)
ASW_F: BACKPMAN30_Charger (U6.3), BACKPMAN30_CPU (U13.A4)
ASW_R: BACKPMAN30_Charger (U6.2), BACKPMAN30_CPU (U13.B4)
CAN0_RX: BACKPMAN30_CPU (U13.D8), BACKPMAN30_Intfs (U15.4)
CAN0_TX: BACKPMAN30_CPU (U13.E8), BACKPMAN30_Intfs (U15.1)
CAN_EN: BACKPMAN30_CPU (U13.G10), BACKPMAN30_Intfs (U15.6)
CAN_STB: BACKPMAN30_CPU (U13.D7), BACKPMAN30_Intfs (U15.14)
DCDC_MODE: BACKPMAN30_Charger (R34.2), BACKPMAN30_CPU (U13.K6)
DCDC_PGOOD: BACKPMAN30_Charger (U10.6), BACKPMAN30_CPU (U13.J6)
EN_CHARGER: BACKPMAN30_Charger (R35.2), BACKPMAN30_CPU (U13.K5)
ENC_A: BACKPMAN30_CPU (U13.D9), BACKPMAN30_Intfs (R59.1 SW1.A)
ENC_B: BACKPMAN30_CPU (U13.H6), BACKPMAN30_Intfs (R60.1 SW1.B)
ENC_SW: BACKPMAN30_CPU (U13.J10), BACKPMAN30_Intfs (R61.1 SW1.4)
LED_GR: BACKPMAN30_CPU (U13.A8), BACKPMAN30_Intfs (U16.2)
LED_RD: BACKPMAN30_CPU (U13.J7), BACKPMAN30_Intfs (U17.2)
LEDCAN0: BACKPMAN30_CPU (U13.G9), BACKPMAN30_Intfs (LED1.2)
LOAD_I: BACKPMAN30_CPU (U13.E2), BACKPMAN30_PwrSw (C108.2 R71.2)
LOAD_V: BACKPMAN30_CPU (U13.H4), BACKPMAN30_PwrSw (C107.1 R69.2 U24.1)
LSW_F: BACKPMAN30_CPU (U13.H8), BACKPMAN30_PwrSw (U25.3)
OLED_CLK: BACKPMAN30_CPU (U13.A3), BACKPMAN30_Intfs (DSP1.3)
OLED_CS: BACKPMAN30_CPU (U13.C3), BACKPMAN30_Intfs (DSP1.7)
OLED_DC: BACKPMAN30_CPU (U13.B3), BACKPMAN30_Intfs (DSP1.6)
OLED_DIN: BACKPMAN30_CPU (U13.E3), BACKPMAN30_Intfs (DSP1.4)
OLED_RES: BACKPMAN30_CPU (U13.A2), BACKPMAN30_Intfs (DSP1.5)
OLEDV: BACKPMAN30_CPU (U13.C6), BACKPMAN30_Intfs (DSP1.8)
OUT1: BACKPMAN30_CPU (U13.F10), BACKPMAN30_PwrSw (Q15.1)
OUT2: BACKPMAN30_CPU (U13.E10), BACKPMAN30_PwrSw (Q14.1)
OUT3: BACKPMAN30_CPU (U13.G7), BACKPMAN30_PwrSw (Q16.1)
OUT4: BACKPMAN30_CPU (U13.H7), BACKPMAN30_PwrSw (Q17.1)
PSRC_I: BACKPMAN30_Charger (C4.1 R6.1), BACKPMAN30_CPU (U13.K3)
PSRC_V: BACKPMAN30_Charger (C5.1 R1.2 U1.1), BACKPMAN30_CPU (U13.F3)
PSW_F: BACKPMAN30_Charger (U5.3), BACKPMAN30_CPU (U13.H10)
PSW_R: BACKPMAN30_Charger (U5.2), BACKPMAN30_CPU (U13.J8)
RESET: BACKPMAN30_CPU (C62.1 U13.E1), BACKPMAN30_Intfs (R54.1 X4.10)
SPI1_MOSI: BACKPMAN30_Charger (U10.5), BACKPMAN30_CPU (U13.C5)
SPI1_NSS: BACKPMAN30_Charger (U10.4), BACKPMAN30_CPU (U13.G3)
SPI1_SCK: BACKPMAN30_Charger (U10.3), BACKPMAN30_CPU (U13.H3)
SWD_CLK: BACKPMAN30_CPU (U13.A9), BACKPMAN30_Intfs (R52.1 X4.4)
SWD_DIO: BACKPMAN30_CPU (U13.A10), BACKPMAN30_Intfs (R48.1 X4.2)
SWO: BACKPMAN30_CPU (U13.A7), BACKPMAN30_Intfs (X4.6)
SYS_V: BACKPMAN30_Charger (C6.1 R2.2 U2.1), BACKPMAN30_CPU (U13.J4)
TERMO_SENS: BACKPMAN30_Charger (C47.1 R25.1 R27.2), BACKPMAN30_CPU (U13.F1)
UART1_RTS: BACKPMAN30_CPU (U13.G8), BACKPMAN30_Intfs (U14.3)
UART1_RX: BACKPMAN30_CPU (U13.D4), BACKPMAN30_Intfs (U14.1)
UART1_TX: BACKPMAN30_CPU (U13.C4), BACKPMAN30_Intfs (U14.4)
USB_ID: BACKPMAN30_CPU (U13.D10), BACKPMAN30_Intfs (U20.1 X9.4)
USB_N: BACKPMAN30_CPU (U13.C10), BACKPMAN30_Intfs (U20.3 X9.2)
USB_P: BACKPMAN30_CPU (U13.B10), BACKPMAN30_Intfs (U20.2 X9.3)
USB_VBUS: BACKPMAN30_CPU (U13.C9), BACKPMAN30_Intfs (C91.1 C92.1 L5.2 VD10.2)

## Assembly variants
Main_variant: not fitted C42 C77 C78 C79 C80 C81 C82 C83 C84 C85 E1 E2 E3 J1 J2 L5 LCD1 Q5 R52 R54 R55 R57 R58 U14 U19 VD9 X4 X5